# EAGLE design station_v2.3 (EAGLE 9.5.0)
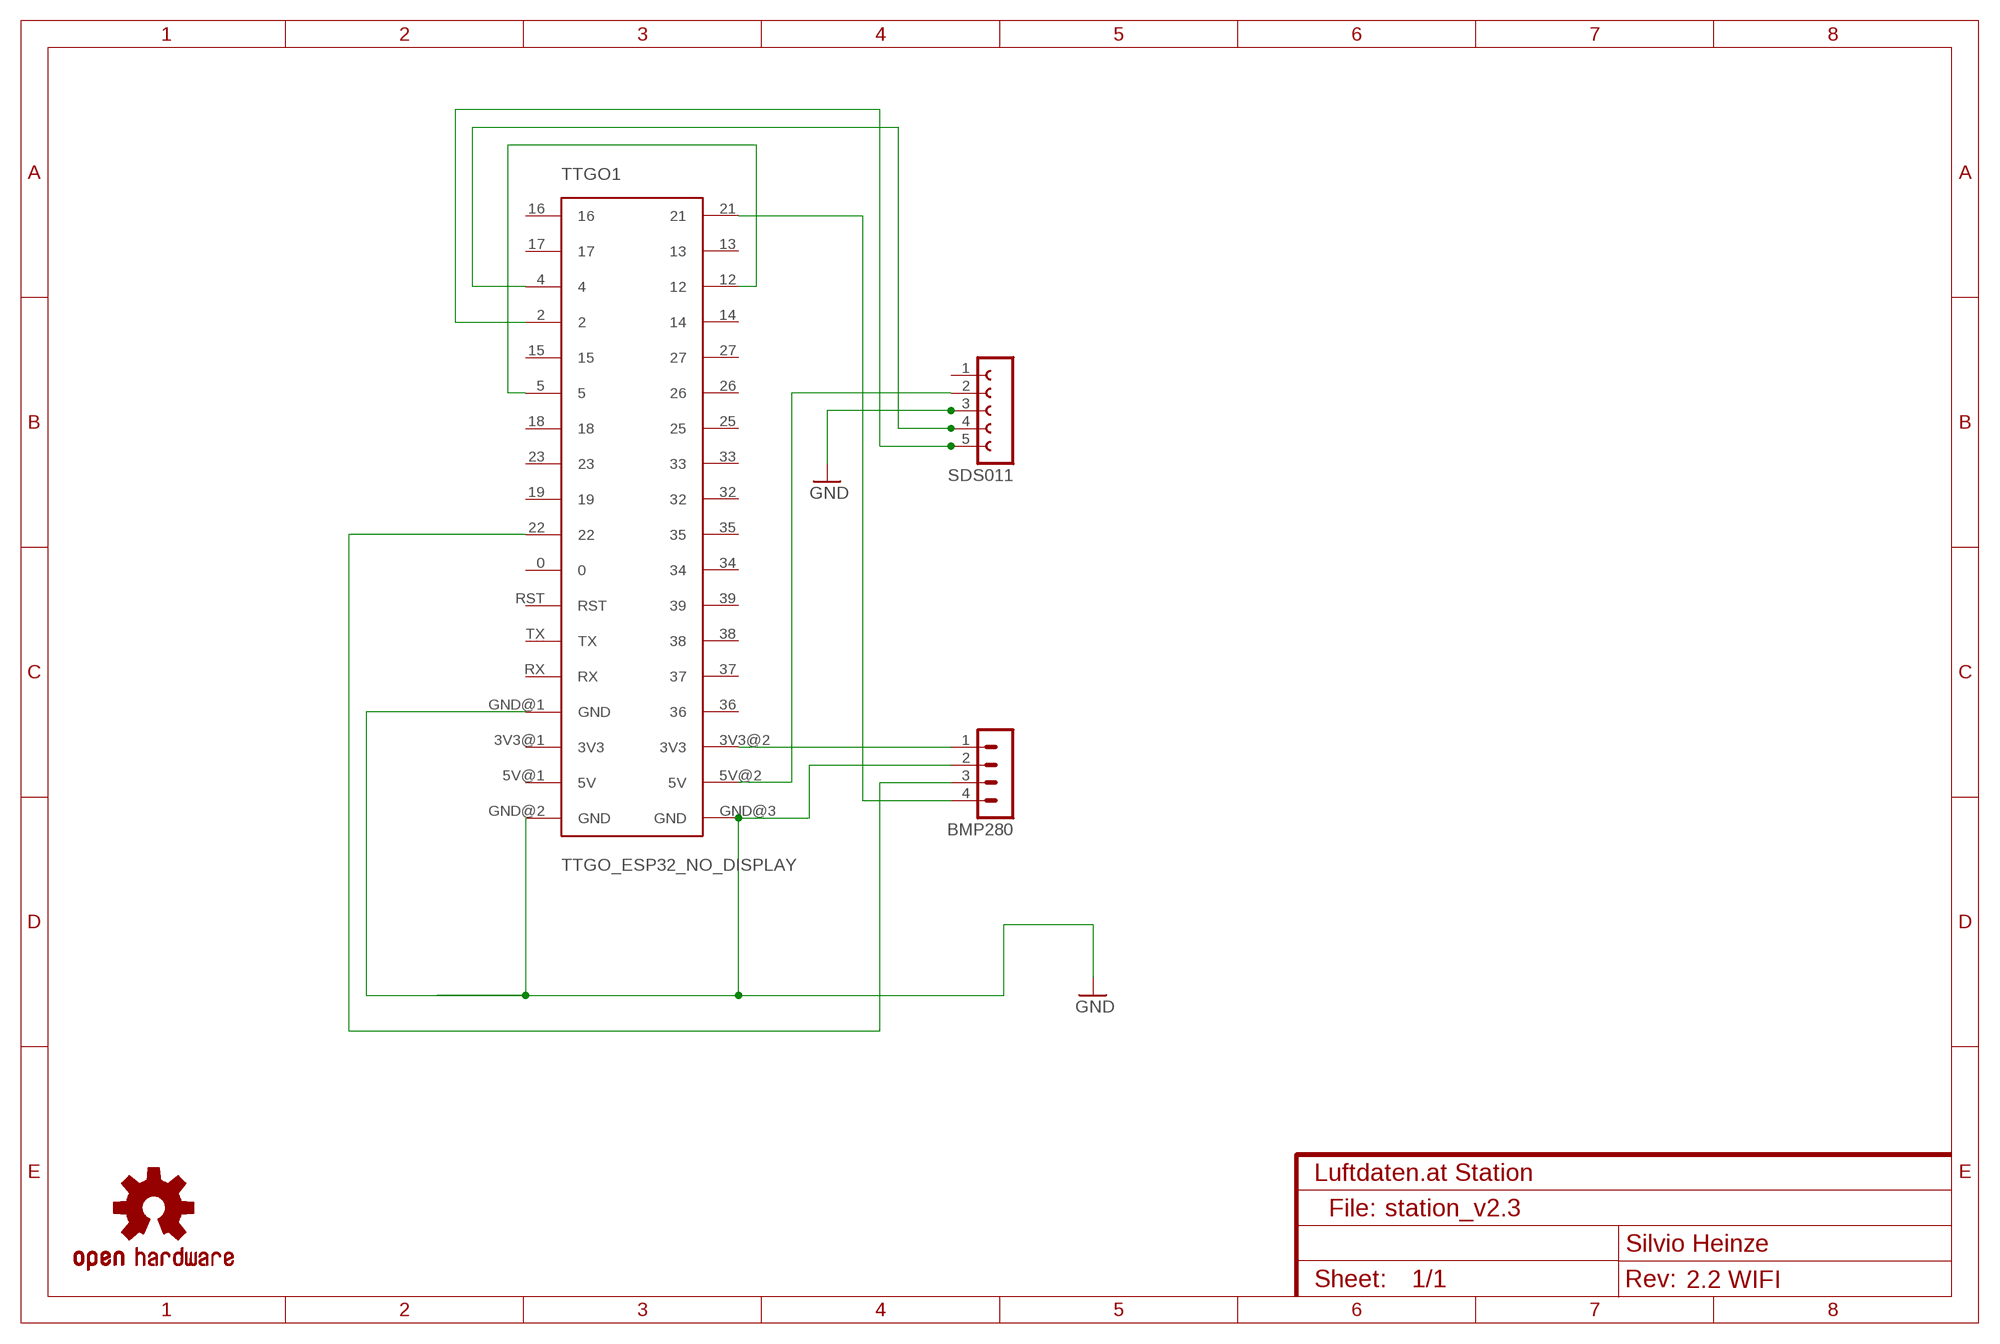
[diagram p0: schematic, sheet 1]
NAME (FRAME-A4L): CNAME: Luftdaten.at Station; CREVISION: 2.2 WIFI; DESIGNER: Silvio Heinze

## Parts
BMP280  MA04-1  [MA04-1]
LOGO2  OSHW-LOGOM  [OSHW-LOGO-M]
SDS011  FE05-1  [FE05-1]
TTGO1  TTGO_ESP32_NO_DISPLAY  [TTGO_ESP32_NO_DISPLAY]

## Nets
GND: BMP280.2 SDS011.3 TTGO1.GND@1(GND) TTGO1.GND@2(GND) TTGO1.GND@3(GND)
GPIO0: SDS011.5 TTGO1.2
GPIO2: SDS011.4 TTGO1.4
N$1: SDS011.2 TTGO1.5V@2(5V)
N$2: BMP280.1 TTGO1.3V3@2(3V3)
N$3: TTGO1.5 TTGO1.12
N$4: BMP280.3 TTGO1.22
N$5: BMP280.4 TTGO1.21
Unconnected: SDS011.1 TTGO1.0 TTGO1.3V3@1(3V3) TTGO1.5V@1(5V) TTGO1.13 TTGO1.14 TTGO1.15 TTGO1.16 TTGO1.17 TTGO1.18 TTGO1.19 TTGO1.23 TTGO1.25 TTGO1.26 TTGO1.27 TTGO1.32 TTGO1.33 TTGO1.34 TTGO1.35 TTGO1.36 TTGO1.37 TTGO1.38 TTGO1.39 TTGO1.RST TTGO1.RX TTGO1.TX

## Notes on the sheet
- File:

## Library data of the parts
BMP280 = con-lstb:MA04-1: PIN HEADER; OC_FARNELL: unknown; OC_NEWARK: unknown
LOGO2 = SparkFun-Aesthetics:OSHW-LOGO: Open-Source Hardware (OSHW) Logo This logo indicates the piece of hardware it is found on incorporates a OSHW license and/or adheres to the definition of open source hardware found here: http://freedomdefined.org/OSHW
SDS011 = con-lsta:FE05-1: FEMALE HEADER; OC_FARNELL: unknown; OC_NEWARK: unknown
TTGO1 = TTGO_32_without_display:TTGO_ESP32_NO_DISPLAY

## Net classes
0 default: width 0.203 mm, drill 0.356 mm, clearance 0.152 mm
1 power: width 0.203 mm, clearance 0.152 mm

## Board
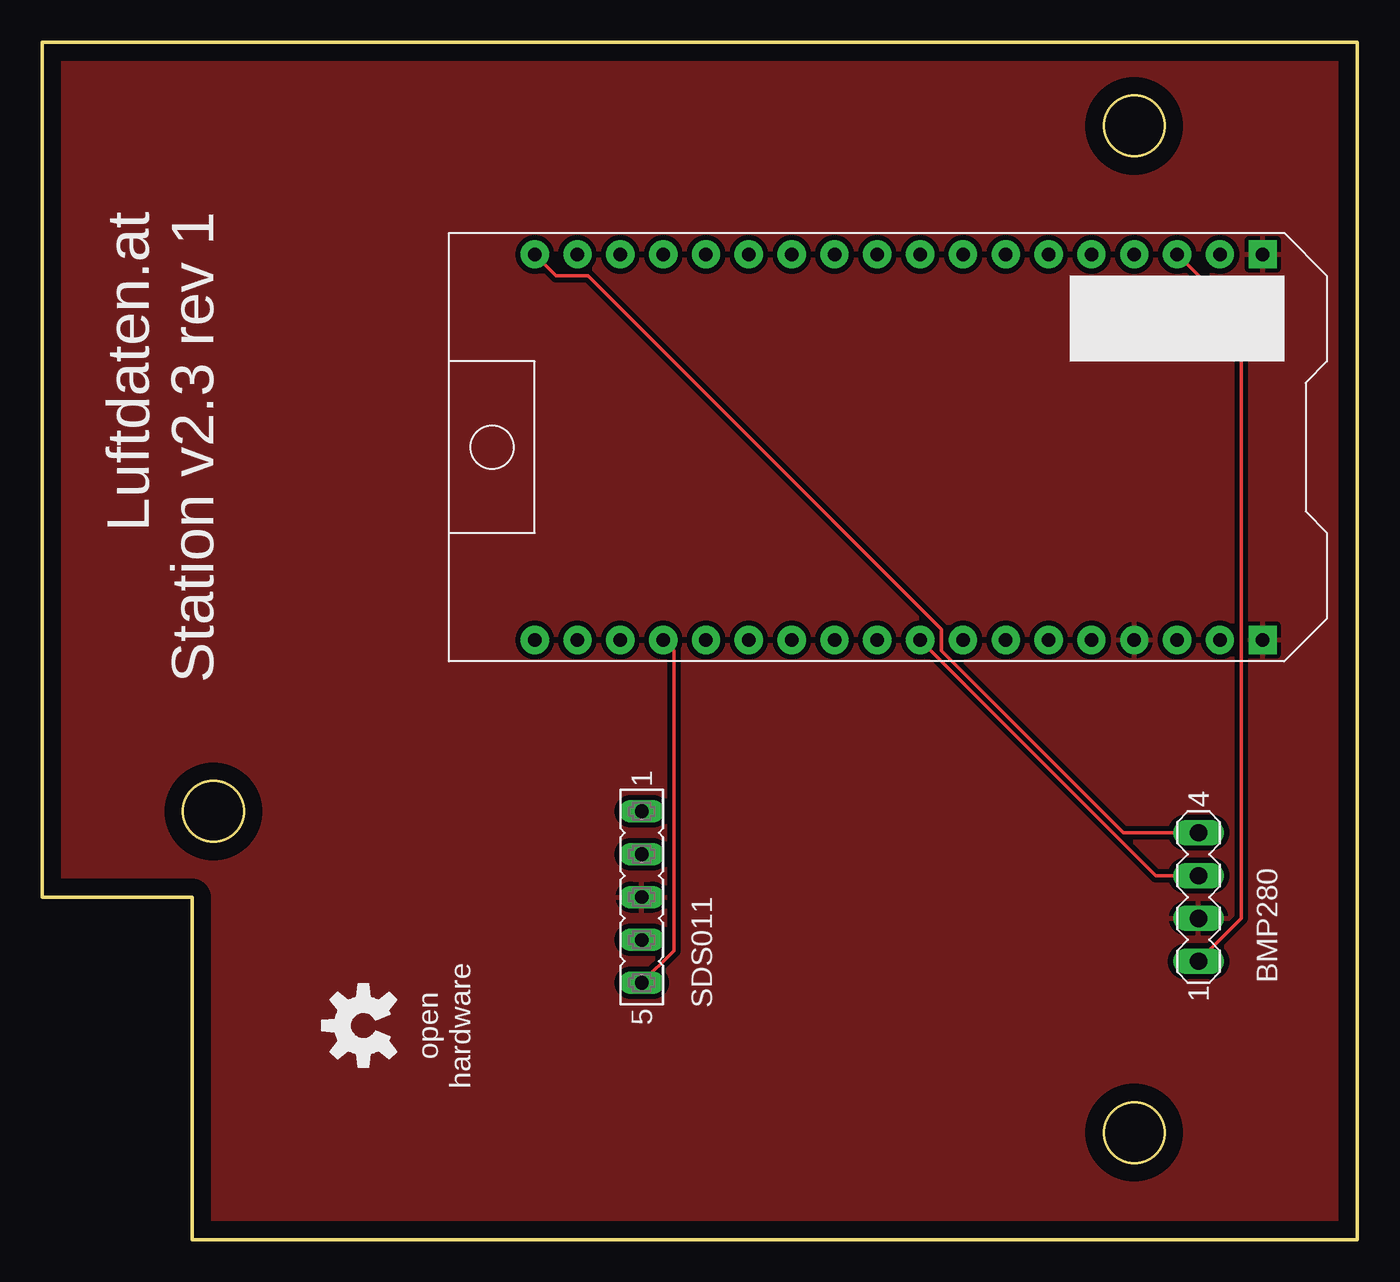
[diagram p1: board, top side]
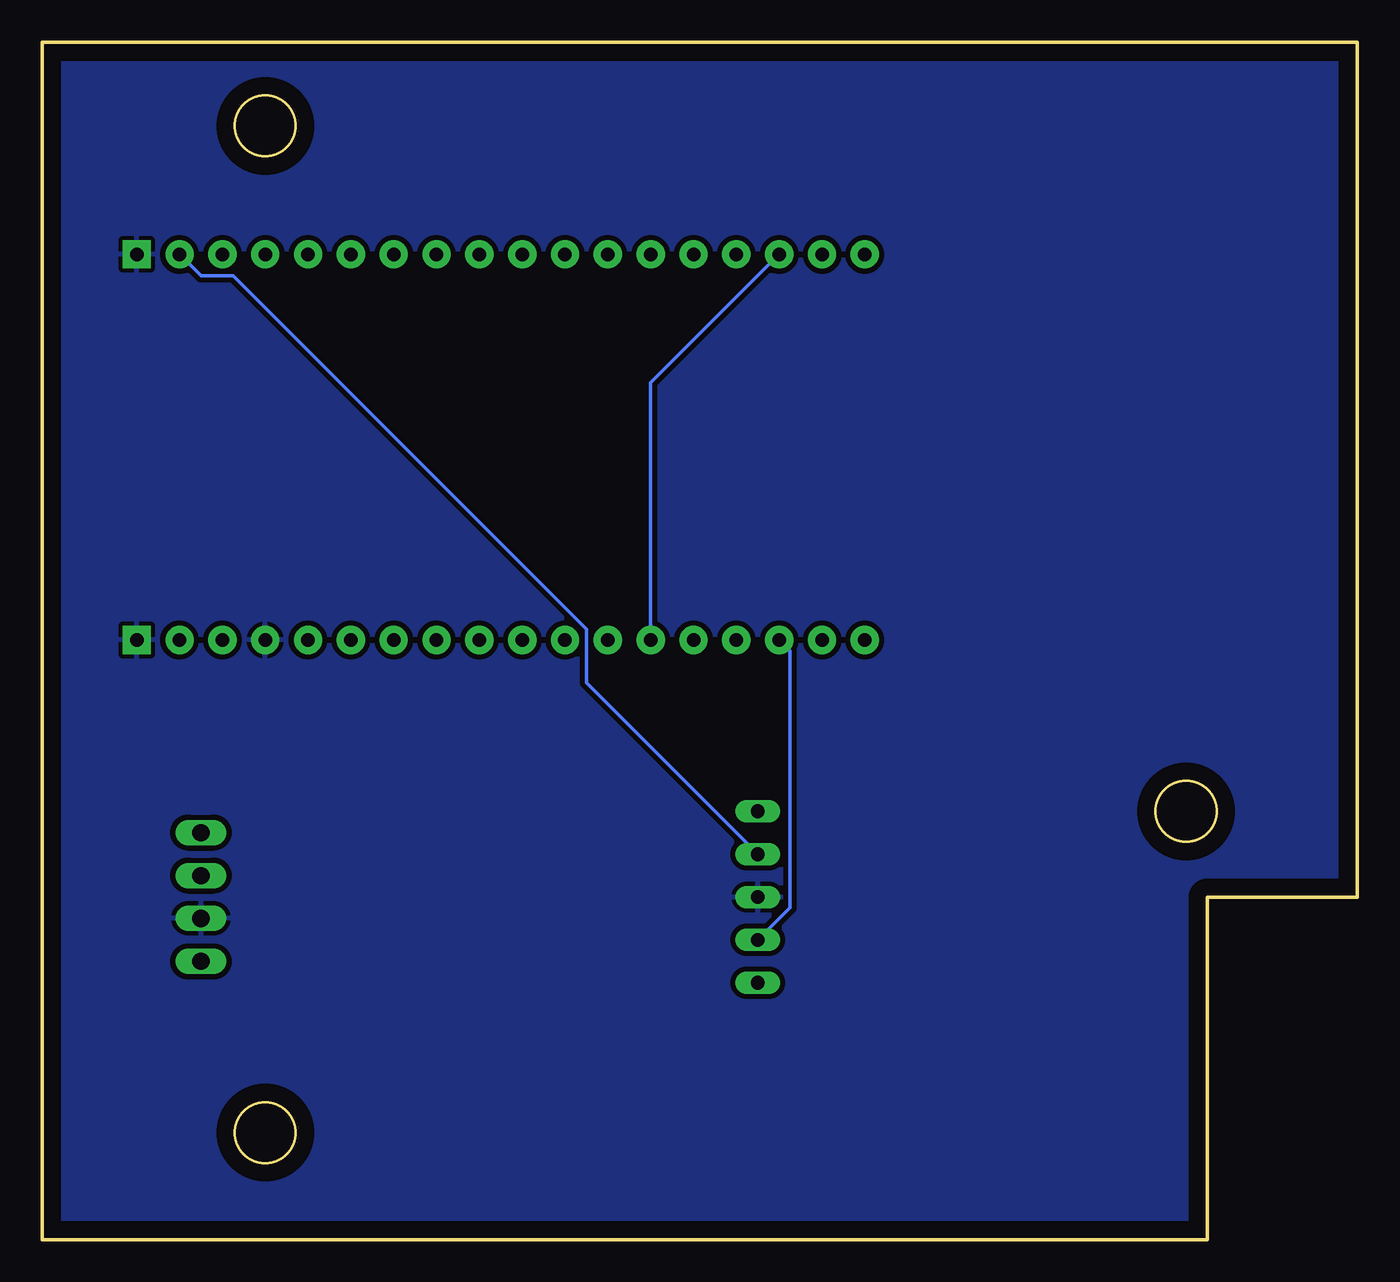
[diagram p2: board, bottom side, seen from below]

Size 78 x 71 mm. Coordinates in mm from the lower left corner, seen from the top.
Outline: 0,71 0,20.32 8.89,20.32 8.89,0 78,0 78,71 0,71
Outline: circle at 64.77,66.04 radius 1.8
Outline: circle at 64.77,6.35 radius 1.8
Outline: circle at 10.16,25.4 radius 1.8
Copper layers (1*16): Top 0.035mm / dielectric 1.5mm / Bottom 0.035mm
Design rules "default": minimum track width 6mil, minimum drill 0.35mm, track to track 6mil, track to pad 6mil, pad to pad 6mil, via to via 6mil, smd to smd 6mil, copper to edge 40mil, drill to drill 6mil, minimum pad ring 10mil, minimum via ring 8mil, stop-mask expansion 4mil, vias tented up to drill 0mil, thermal gap 10mil

### Footprints (pad centres in the part's own frame; a part is rotated, then mirrored left to right if it is on the bottom)
MA04-1 = drill 1.016 long: 1 -3.81,0; 2 -1.27,0; 3 1.27,0; 4 3.81,0
FE05-1 = drill 0.813 long: 1 -5.08,0; 2 -2.54,0; 3 0,0; 4 2.54,0; 5 5.08,0
TTGO_ESP32_NO_DISPLAY = drill 0.8 pad 1.676: 0 1.27,-30.48; 2 1.27,-12.7; 3V3@1 1.27,-43.18; 3V3@2 24.13,-43.18; 4 1.27,-10.16; 5 1.27,-17.78; 5V@1 1.27,-45.72; 5V@2 24.13,-45.72; 12 24.13,-10.16; 13 24.13,-7.62; 14 24.13,-12.7; 15 1.27,-15.24; 16 1.27,-5.08; 17 1.27,-7.62; 18 1.27,-20.32; 19 1.27,-25.4; 21 24.13,-5.08; 22 1.27,-27.94; 23 1.27,-22.86; 25 24.13,-20.32; 26 24.13,-17.78; 27 24.13,-15.24; 32 24.13,-25.4; 33 24.13,-22.86; 34 24.13,-30.48; 35 24.13,-27.94; 36 24.13,-40.64; 37 24.13,-38.1; 38 24.13,-35.56; 39 24.13,-33.02; GND@1 1.27,-40.64; RST 1.27,-33.02; RX 1.27,-38.1; TX 1.27,-35.56 | drill 0.8 pad 1.676 square: GND@2 1.27,-48.26; GND@3 24.13,-48.26

### Placement (x,y rotation side)
BMP280  68.58,20.32 90 top
LOGO2  19.05,12.7 90 top
SDS011  35.56,20.32 270 top
TTGO1  24.13,34.29 90 top

### Tracks (layer width: path | path; a pad name or v marks a point on that pad's centre or on a via)
GND
  pour Top (isolate 0.305): 0,71.12 0,20.32 8.89,20.32 8.89,0 77.47,0 77.47,71.12
  pour Bottom (isolate 0.305): 0,71.12 0,20.32 8.89,20.32 8.89,0 77.47,0 77.47,71.12
GPIO0
  Top 0.203: SDS011.5 37.47,17.14 37.47,34.92 TTGO1.2
GPIO2
  Bottom 0.203: SDS011.4 33.66,19.68 33.66,34.92 TTGO1.4
N$1
  Bottom 0.203: SDS011.2 45.72,33.02 45.72,36.2 66.67,57.15 68.58,57.15 TTGO1.5V@2
N$2
  Top 0.203: BMP280.1 71.12,19.05 71.12,54.61 TTGO1.3V3@2
N$3
  Bottom 0.203: TTGO1.5 41.91,50.8 TTGO1.12
N$4
  Top 0.203: BMP280.3 66.04,21.59 TTGO1.22
N$5
  Top 0.203: BMP280.4 64.14,24.13 53.34,34.92 53.34,36.2 32.38,57.15 30.48,57.15 TTGO1.21

### Text on the board
tNames: Luftdaten.at / Station v2.3 rev 1 | open / hardware